# EAGLE design Nucleo-F042K6 - mj8x8 gateway- rev.1 - TCAN334 - poc (EAGLE 9.6.2)
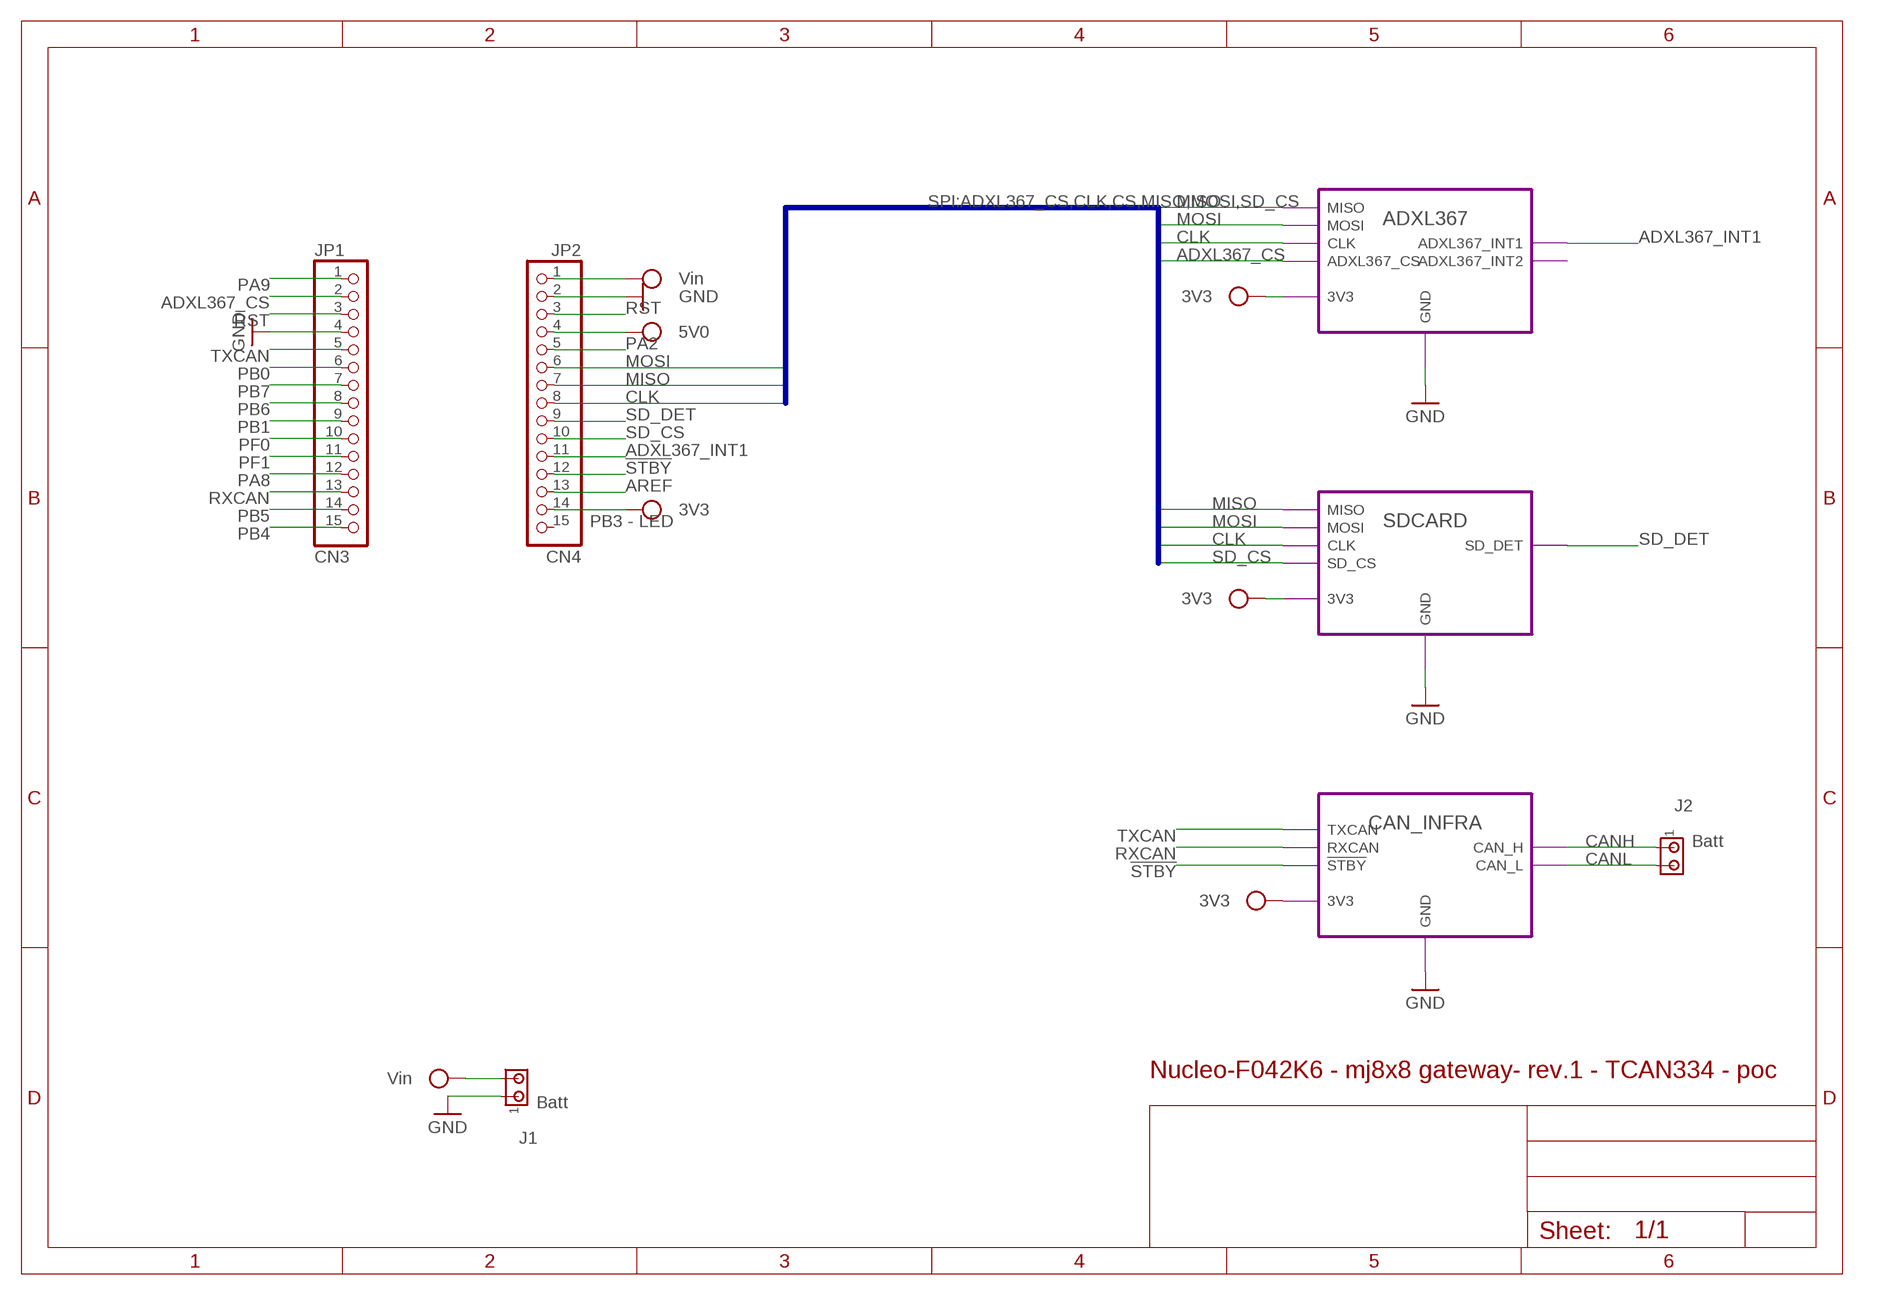
[diagram p0: schematic, sheet 1]

## Parts
J1  Batt  MTA02-100  [10X02MTA]
J2  Batt  MTA02-100  [10X02MTA]
JP1  CN3  PINHD-1X15  [1X15]
JP2  CN4  PINHD-1X15  [1X15]

## Module instances
CAN_INFRA = CAN (part numbers offset by 400)
ADXL367 = ADXL367 (part numbers offset by 200)
SDCARD = SDCARD (part numbers offset by 300)

## Nets
3V3 [3V3]: JP2.14 ; port CAN_INFRA.3V3 SDCARD.3V3 ADXL367.3V3
5V0: JP2.4
!STBY! [signal]: JP2.12 ; port CAN_INFRA.!STBY!
ADXL367_CS: JP1.2 ; port ADXL367.ADXL367_CS
ADXL367_INT1: JP2.11 ; port ADXL367.ADXL367_INT1
AREF: JP2.13
CANH: J2.1 ; port CAN_INFRA.CAN_H
CANL: J2.2 ; port CAN_INFRA.CAN_L
CLK: JP2.8 ; port SDCARD.CLK ADXL367.CLK
GND: J1.1 JP1.4 JP2.2 ; port CAN_INFRA.GND SDCARD.GND ADXL367.GND
MISO: JP2.7 ; port SDCARD.MISO ADXL367.MISO
MOSI: JP2.6 ; port SDCARD.MOSI ADXL367.MOSI
PA2: JP2.5
PA8: JP1.12
PA9: JP1.1
PB0: JP1.6
PB1: JP1.9
PB4: JP1.15
PB5: JP1.14
PB6: JP1.8
PB7: JP1.7
PF0: JP1.10
PF1: JP1.11
RST: JP1.3 JP2.3
RXCAN [signal]: JP1.13 ; port CAN_INFRA.RXCAN
SD_CS: JP2.10 ; port SDCARD.SD_CS
SD_DET: JP2.9 ; port SDCARD.SD_DET
TXCAN [signal]: JP1.5 ; port CAN_INFRA.TXCAN
VIN [3V3]: J1.2 JP2.1 ; supply symbol labelled Vin
Unconnected: JP2.15

## Buses
SPI:ADXL367_CS,CLK,CS,MISO,MOSI,SD_CS

## Notes on the sheet
- PB3 - LED

## Library data of the parts
J1 J2 = con-amp:MTA02-100: AMP connector
JP1 JP2 = pinhead:PINHD-1X15: PIN HEADER

## Module CAN
Ports: TXCAN(in) RXCAN(out) !STBY!(in) 3V3(pwr) GND(pwr) CAN_H(io) CAN_L(io)
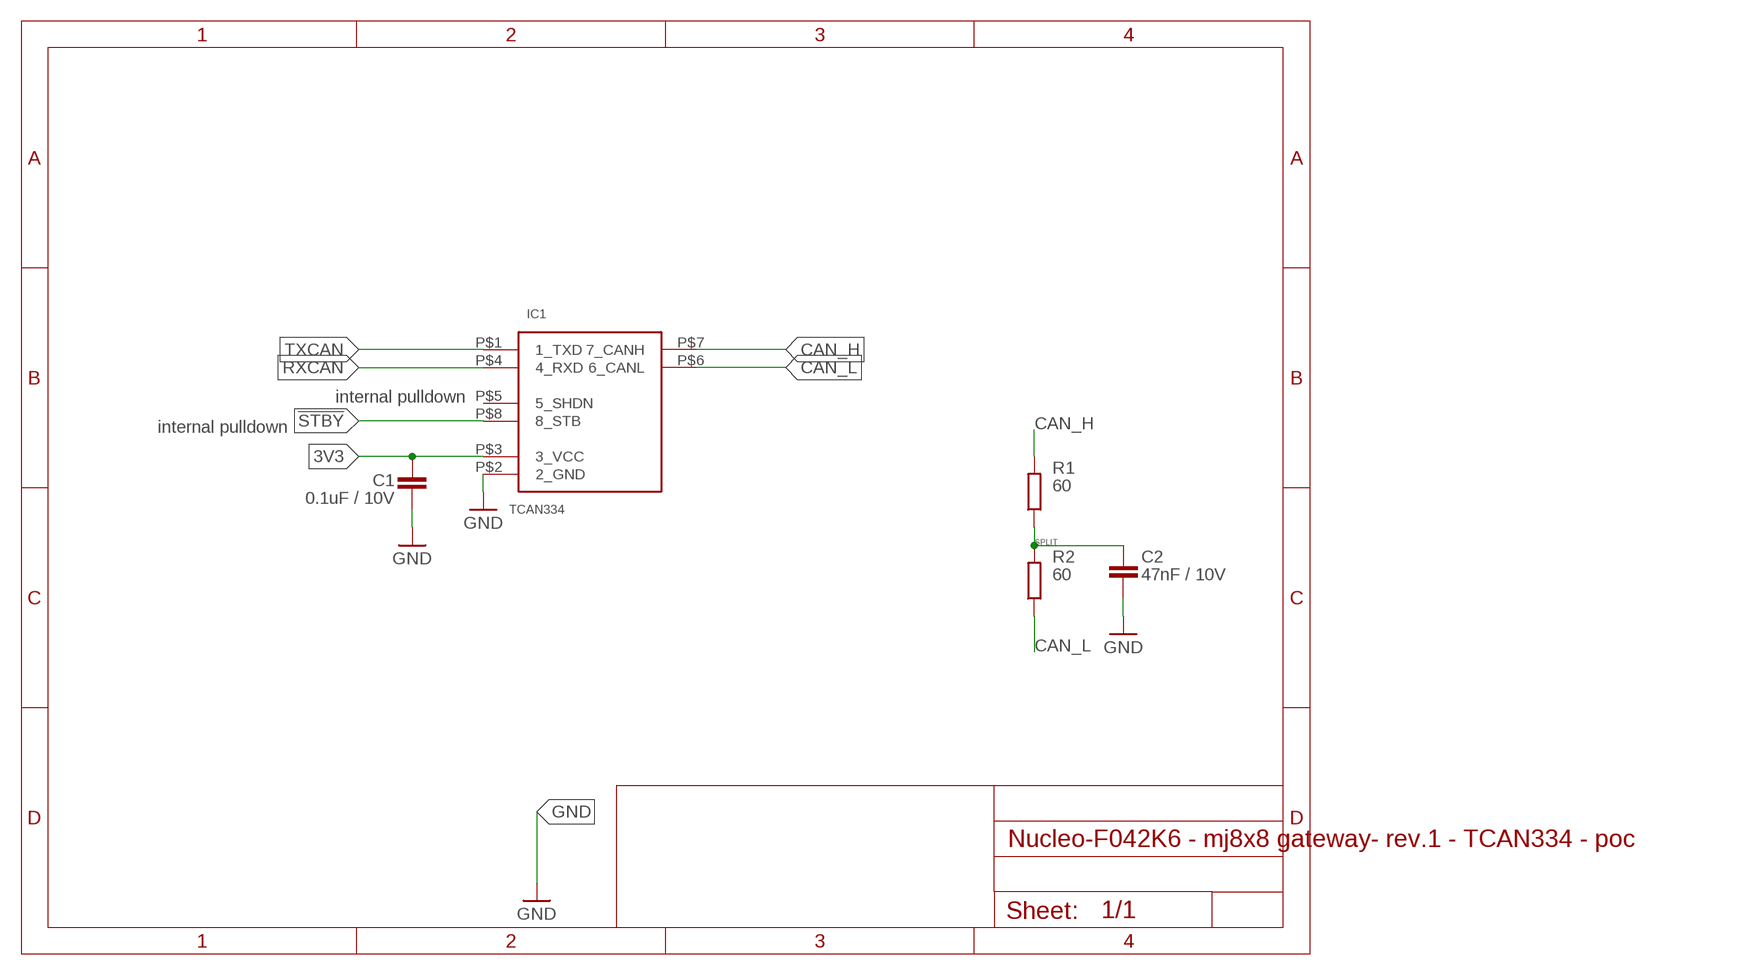
[diagram p1: schematic, module CAN, sheet 1]

### Parts
C1  0.1uF / 10V  C-EUC0402  [C0402]
C2  47nF / 10V  C-EUC0402  [C0402]
IC1  TCAN334  CAN33X  [SOT23-8]
R1  60  R-EU_R0805  [R0805]
R2  60  R-EU_R0805  [R0805]

### Nets
3V3 [3V3]: C1.1 IC1.P$3(3_VCC)
!STBY! [signal]: IC1.P$8(8_STB)
CAN_H [signal]: IC1.P$7(7_CANH) R1.2
CAN_L [signal]: IC1.P$6(6_CANL) R2.1
GND: C1.2 C2.2 IC1.P$2(2_GND)
RXCAN [signal]: IC1.P$4(4_RXD)
SPLIT [signal]: C2.1 R1.1 R2.2
TXCAN [signal]: IC1.P$1(1_TXD)
Unconnected: IC1.P$5(5_SHDN)

### Notes on the sheet
- internal pulldown
- internal pulldown

### Library data of the parts
C1 C2 = rcl:C-EU: CAPACITOR, European symbol; SPICEPREFIX: C
IC1 = TCAN33x - 3.3V CAN Transciever:CAN33X
R1 R2 = rcl:R-EU_: RESISTOR, European symbol; SPICEPREFIX: R

## Module ADXL367
Ports: GND(pwr) 3V3(pwr) MISO(out) MOSI(in) CLK(in) ADXL367_CS(in) ADXL367_INT1(out) ADXL367_INT2(out)
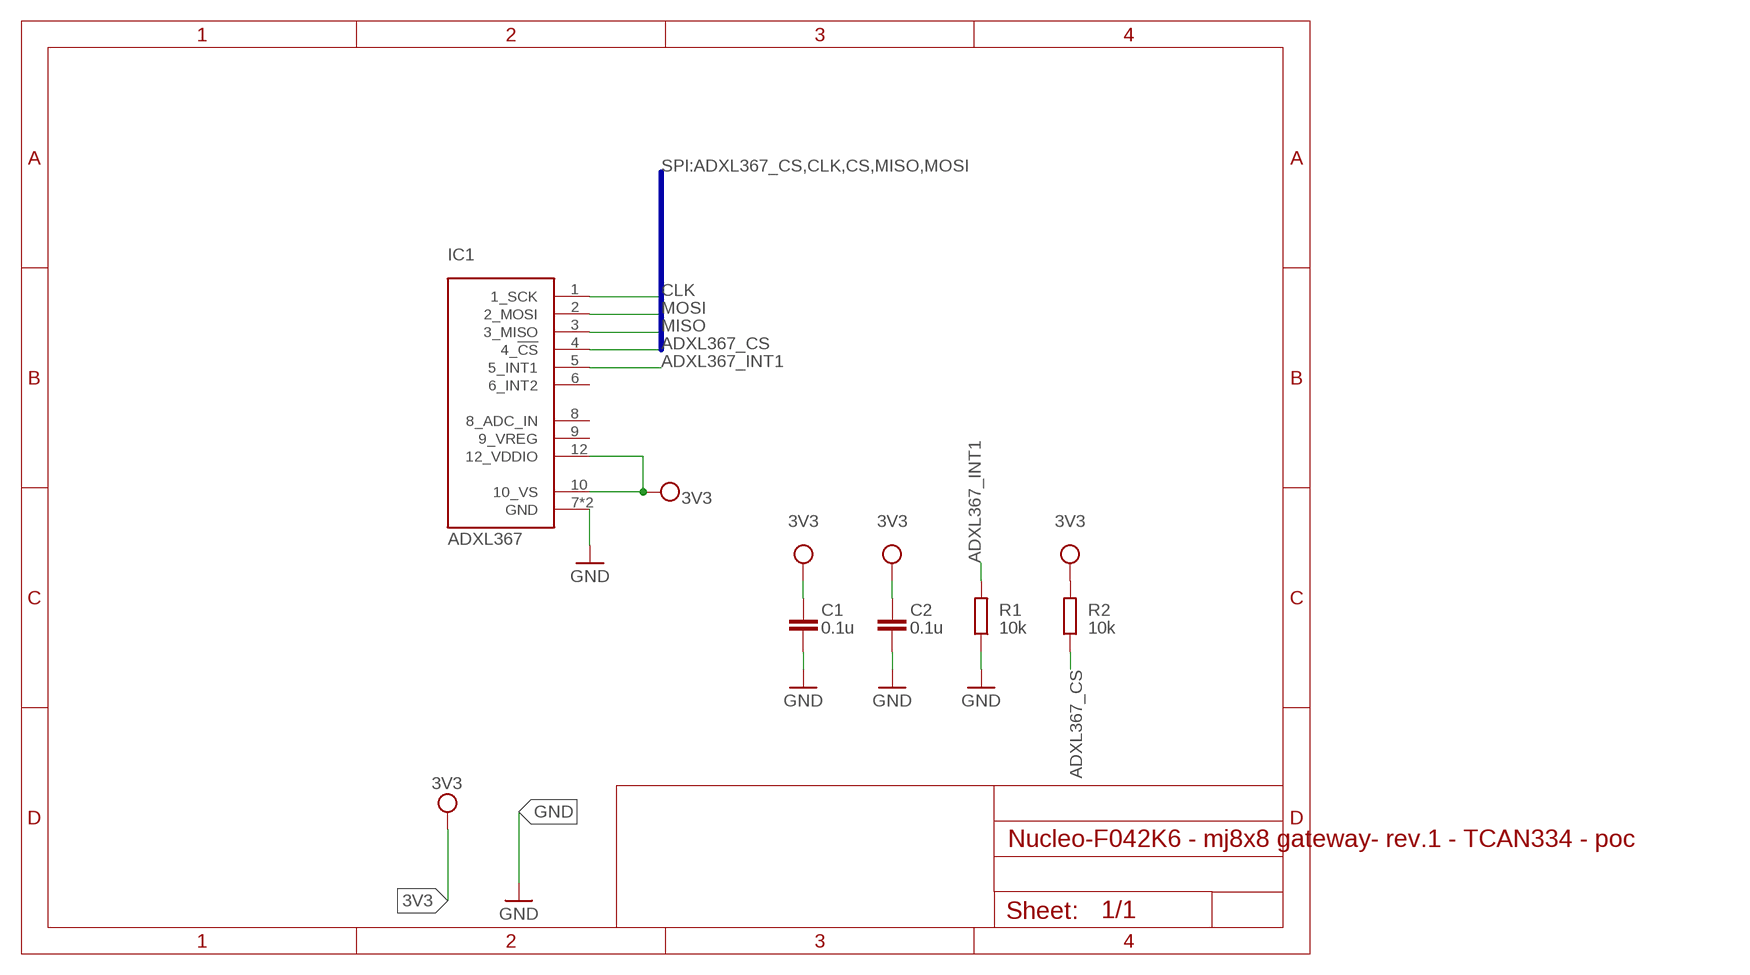
[diagram p2: schematic, module ADXL367, sheet 1]

### Parts
C1  0.1u  C-EUC0402  [C0402]
C2  0.1u  C-EUC0402  [C0402]
IC1  ADXL367  [LGA]
R1  10k  R-EU_R0402  [R0402]
R2  10k  R-EU_R0402  [R0402]

### Nets
3V3 [3V3]: C1.1 C2.1 IC1.10(10_VS) IC1.12(12_VDDIO) R2.2
ADXL367_CS: IC1.4(4_!CS!) R2.1
ADXL367_INT1: IC1.5(5_INT1) R1.2
CLK: IC1.1(1_SCK)
GND: C1.2 C2.2 IC1.7(GND) IC1.11(GND) R1.1
MISO: IC1.3(3_MISO)
MOSI: IC1.2(2_MOSI)
Unconnected: IC1.6(6_INT2) IC1.8(8_ADC_IN)

### Buses
SPI:ADXL367_CS,CLK,CS,MISO,MOSI

### Power pins joined to a net without a drawn wire
9_VREG: IC1.9(9_VREG)

### Library data of the parts
C1 C2 = rcl:C-EU: CAPACITOR, European symbol; SPICEPREFIX: C
IC1 = ADXL 367 - Accelerometer:ADXL367
R1 R2 = rcl:R-EU_: RESISTOR, European symbol; SPICEPREFIX: R

## Module SDCARD
Ports: MISO(out) MOSI(in) CLK(in) SD_CS(in) 3V3(pwr) GND(pwr) SD_DET(out)
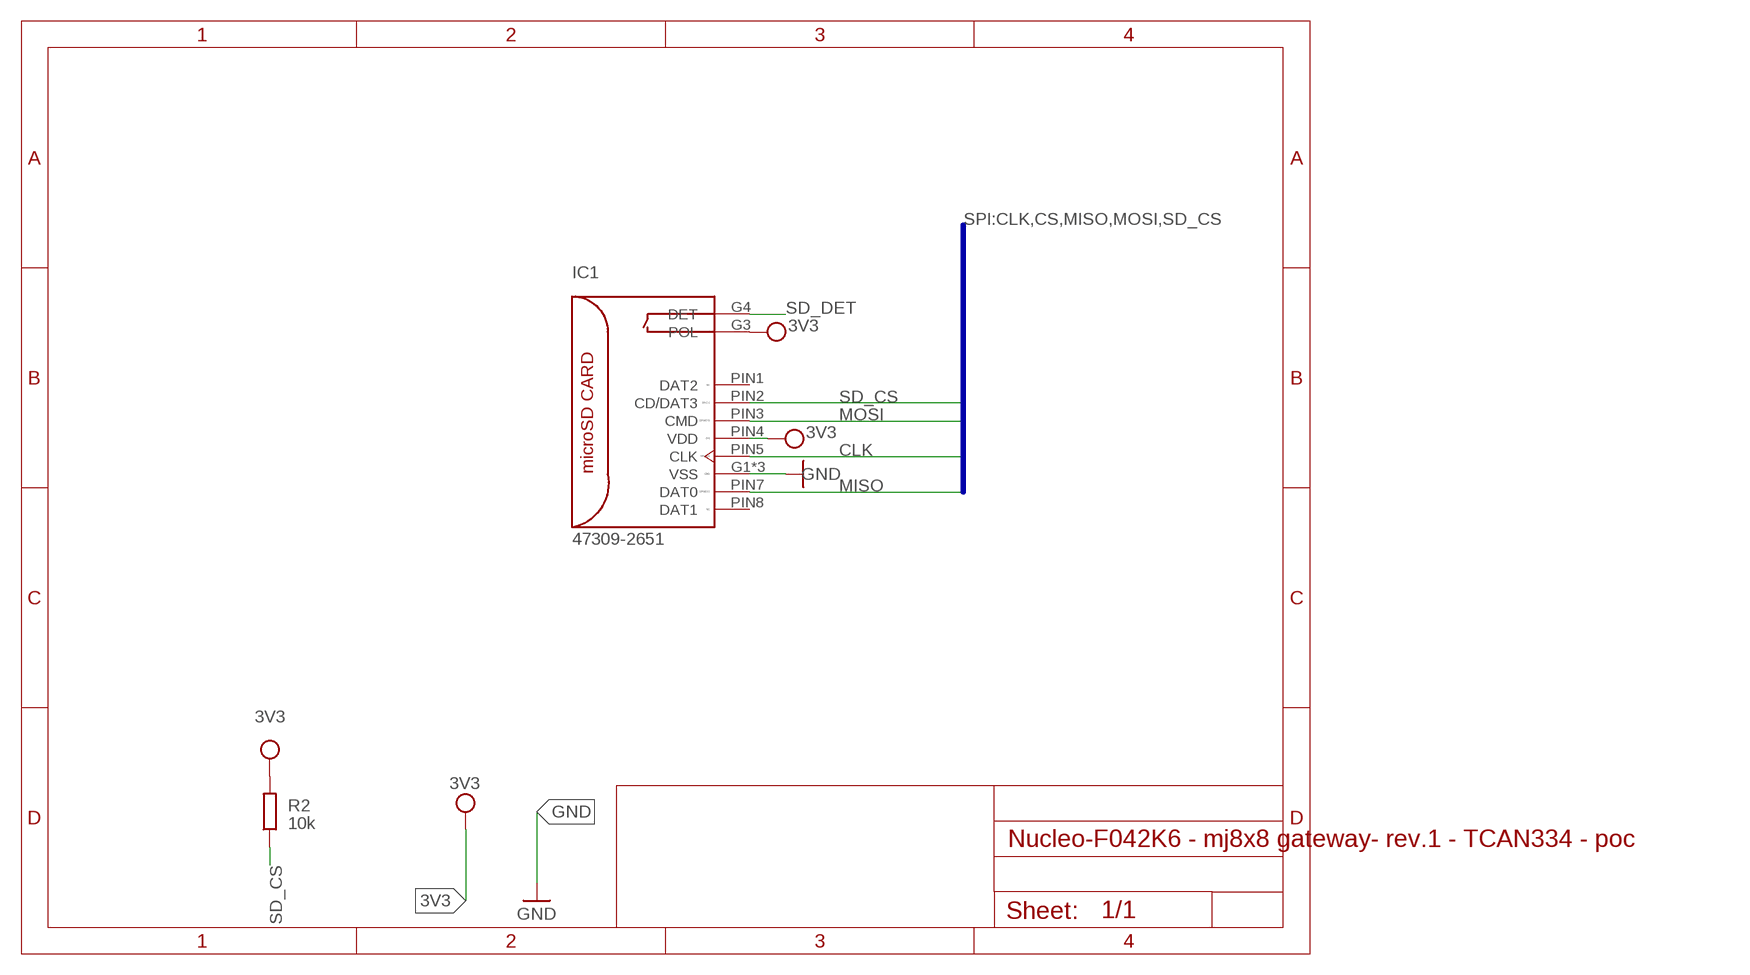
[diagram p3: schematic, module SDCARD, sheet 1]

### Parts
IC1  47309-2651  MICROSD_SPI_MODE  [MICRO_SD_CONNECTOR]
R2  10k  R-EU_R0402  [R0402]

### Nets
3V3 [3V3]: IC1.G3(POL) IC1.PIN4(VDD) R2.2
CLK: IC1.PIN5(CLK)
GND: IC1.G1(VSS) IC1.G2(VSS) IC1.PIN6(VSS)
MISO: IC1.PIN7(DAT0)
MOSI: IC1.PIN3(CMD)
SD_CS: IC1.PIN2(CD/DAT3) R2.1
SD_DET: IC1.G4(DET)
Unconnected: IC1.PIN1(DAT2) IC1.PIN8(DAT1)

### Buses
SPI:CLK,CS,MISO,MOSI,SD_CS

### Library data of the parts
IC1 = Molex SD-47309 SD Card Slot:MICROSD_SPI_MODE: MOLEX - 49225-0821 - CONNECTEUR MICRO SD PUSH/PUSH REV Fabricant: MOLEX Code commande Farnell: 1366700 <http://fr.farnell.com/molex/49225-0821/connecteur-micro-sd-push-push-rev/dp/1366700?Ntt=1366700> Référence fabricant: 49225-0821
R2 = rcl:R-EU_: RESISTOR, European symbol; SPICEPREFIX: R

## Net classes
0 GND: width 0.25 mm, drill 0.35 mm, clearance 0.19 mm
3 signal: width 0.25 mm, drill 0.35 mm, clearance 0.19 mm
4 3V3: width 0.25 mm, drill 0.35 mm, clearance 0.19 mm

## Board
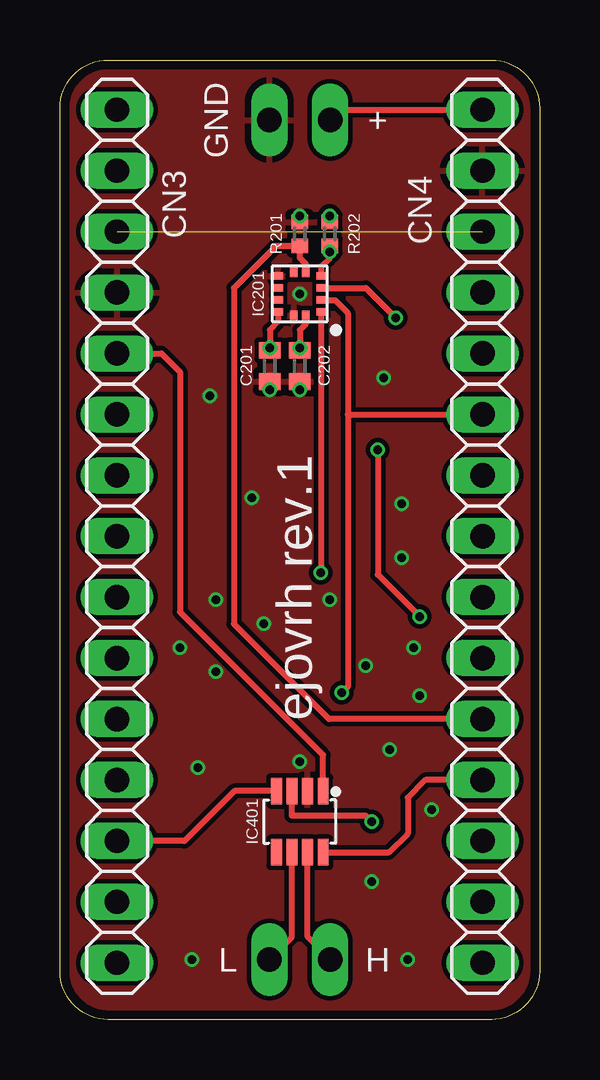
[diagram p4: board, top side]
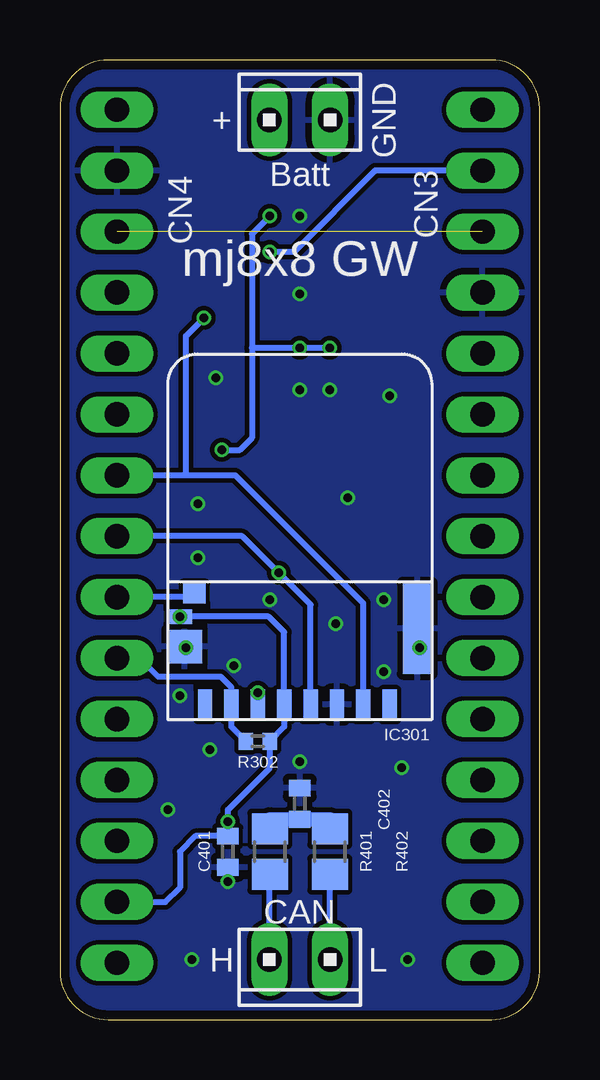
[diagram p5: board, bottom side, seen from below]

Size 20 x 40 mm. Coordinates in mm from the lower left corner, seen from the top.
Outline: 18,0 2,0 arc-90 0,2 0,38 arc-90 2,40 18,40 arc-90 20,38 20,2 arc-90 18,0
Copper layers (1*16): Top 0.035559375mm / dielectric 1.6mm / Bottom 0.035559375mm
Design rules "oshpark-2layer": minimum track width 6mil, minimum drill 10mil, track to track 6mil, track to pad 6mil, pad to pad 6mil, via to via 6mil, smd to smd 6mil, copper to edge 15mil, drill to drill 6mil, minimum pad ring 5mil, minimum via ring 5mil, stop-mask expansion 2.5mil, vias tented up to drill 0mil, thermal gap 10mil

### Footprints (pad centres in the part's own frame; a part is rotated, then mirrored left to right if it is on the bottom)
C0402 = smd 0.7 x 0.9: 1 -0.65,0; 2 0.65,0
LGA = smd 0.39 x 0.33: 1 -0.9,0.75; 2 -0.9,0.25; 3 -0.9,-0.25; 4 -0.9,-0.75; 7 0.9,-0.75; 8 0.9,-0.25; 9 0.9,0.25; 10 0.9,0.75 | smd 0.33 x 0.39: 5 -0.25,-0.9; 6 0.25,-0.9; 11 0.25,0.9; 12 -0.25,0.9
MICRO_SD_CONNECTOR = smd 1.2 x 3.79: G1 0.6,-3.81 | smd 1.45 x 1.4: G2 10.3,-3.05 | smd 1 x 0.6: G3 10.5,-4.3 | smd 0.95 x 0.85: G4 9.9,-5.27 | smd 0.6 x 1.25: PIN1 9.45,-0.63; PIN2 8.35,-0.63; PIN3 7.25,-0.63; PIN4 6.15,-0.63; PIN5 5.05,-0.63; PIN6 3.95,-0.63; PIN7 2.85,-0.63; PIN8 1.75,-0.63
SOT23-8 = smd 0.45 x 1.1: P$1 -0.975,-1.275; P$2 -0.325,-1.275; P$3 0.325,-1.275; P$4 0.975,-1.275; P$5 0.975,1.275; P$6 0.325,1.275; P$7 -0.325,1.275; P$8 -0.975,1.275
10X02MTA = drill 1.016 long: 1 1.27,0; 2 -1.27,0
1X15 = drill 1.016 long: 1 -17.78,0; 2 -15.24,0; 3 -12.7,0; 4 -10.16,0; 5 -7.62,0; 6 -5.08,0; 7 -2.54,0; 8 0,0; 9 2.54,0; 10 5.08,0; 11 7.62,0; 12 10.16,0; 13 12.7,0; 14 15.24,0; 15 17.78,0
R0402 = smd 0.6 x 0.7: 1 -0.5,0; 2 0.5,0
R0805 = smd 1.3 x 1.5: 1 -0.95,0; 2 0.95,0

### Placement (x,y rotation side)
C201  0.1u  [C0402]  8.75,27.25 270 top
C202  0.1u  [C0402]  10,27.25 270 top
C401  0.1uF / 10V  [C0402]  13,7 270 bottom
C402  47nF / 10V  [C0402]  10,9 90 bottom
IC201  ADXL367  [LGA]  10,30.25 180 top
IC301  47309-2651  [MICRO_SD_CONNECTOR]  4.5,12.5 180 bottom
IC401  TCAN334  [SOT23-8]  10,8.25 180 top
J1  10,37.5 0 bottom
J2  10,2.5 180 bottom
JP1  2.38,20.15 270 top
JP2  17.62,20.15 270 top
R201  10k  [R0402]  10,32.75 270 top
R202  10k  [R0402]  11.25,32.75 90 top
R302  10k  [R0402]  11.75,11.6 0 bottom
R401  60  [R0805]  11.25,7 270 bottom
R402  60  [R0805]  8.75,7 90 bottom

### Tracks (layer width: path | path; a pad name or v marks a point on that pad's centre or on a via)
3V3  (via drill 0.35)
  Top 0.25: v13,8.25 12.75,8.5 9.68,8.5 IC401.P$3 | IC201.12 10.25,29 10,28.75 v10,28 C202.1 | v13.25,23.75 13.25,18.55 IC301.G3 | IC201.10 9.1,29.1 8.75,28.75 v8.75,28 C201.1 | R202.2 v11.25,33.5
  Bottom 0.25: JP2.14 15.59,4.91 15,5.5 15,7 14.35,7.65 C401.1 v13,8.25 13,8.75 11.25,10.5 R302.2 10.65,12.2 IC301.PIN4 10.65,16.15 11.3,16.8 IC301.G3 | v11.25,33.5 12,32.75 12,28 | v8.75,28 v10,28 12,28 | v13.25,23.75 12.5,23.75 12,24.25 12,28
  other vias: 15,16.8
!STBY!
  Top 0.25: IC401.P$8 13.72,6.97 14.5,7.75 14.5,9.25 15.24,9.99 JP2.12
ADXL367_CS  (via drill 0.35)
  Top 0.25: IC201.4 10.9,31.4 11.25,31.75 v11.25,32 R202.1
  Bottom 0.25: JP1.2 6.86,35.39 10.25,32 v11.25,32
ADXL367_INT1
  Top 0.25: JP2.11 11.22,12.53 7.25,16.5 7.25,30.5 9,32.25 R201.2 10,31.75 10.25,31.5 IC201.5
CAN_INFRA:SPLIT
  Bottom 0.25: R402.2 8.75,8.35 | R401.1 11.25,8.35
  Bottom 0.61: 8.75,8.35 C402.1 11.25,8.35
CANH
  Top 0.25: J2.1 10.32,3.45 IC401.P$7
  Bottom 0.25: J2.1 11.27,6.03 R401.2
CANL
  Top 0.25: J2.2 9.68,3.45 IC401.P$6
  Bottom 0.25: J2.2 8.73,6.03 R402.1
CLK  (via drill 0.35)
  Top 0.25: IC201.1 10.88,29.48 v10.88,18.62
  Bottom 0.25: IC301.PIN5 9.55,17.3 v10.88,18.62 12.4,20.15 JP2.8
GND  (via drill 0.35)
  other vias: 10,10.75 14.75,15.5 5,15.5 13,5.75 6.5,14.5 8.5,16.5 12.75,14.75 11.25,17.5 14.25,19.25 14.25,21.5 6.5,17.5 10,30.25 8.75,26.25 10,26.25 13.75,11.25 5.5,2.5 14.5,2.5 6.25,26 13.5,26.75 8,21.75 5.75,10.5 15.5,8.75 15,13.5 10,33.5
  pour Top: 0,0 20,0 20,40 0,40
  pour Bottom: 0,0 20,0 20,40 0,40
MISO  (via drill 0.35)
  Top 0.25: v14,29.25 12.75,30.5 IC201.3
  Bottom 0.25: IC301.PIN7 7.35,17.35 12.69,22.69 14.75,22.69 | 14.75,22.69 JP2.7 | 14.75,22.69 14.75,28.5 v14,29.25
MOSI  (via drill 0.35)
  Top 0.25: 12,25.23 12,13.88 v11.75,13.63 | 12,25.23 JP2.6 | IC201.2 10.92,29.98 11.47,29.98 12,29.45 12,25.23
  Bottom 0.25: IC301.PIN3 v11.75,13.63
RST  (1 unrouted)
RXCAN
  Top 0.25: IC401.P$4 7.28,9.53 5.2,7.45 JP1.13
SD_CS
  Bottom 0.25: R302.1 12.85,12.2 IC301.PIN2 12.85,13.85 13.29,14.29 15.91,14.29 16.69,15.07 JP2.10
SD_DET
  Bottom 0.25: IC301.G4 14.56,17.61 JP2.9
TXCAN
  Top 0.25: IC401.P$1 10.97,11.02 5,17 5,27 4.23,27.77 JP1.5
VIN
  Top 0.25: J1.2 11.7,37.93 JP2.1

### Text on the board
tPlace: GND | + | CN3 | CN4 | ejovrh rev.1 | L | H
bPlace: GND | + | Batt | CN3 | CN4 | mj8x8 GW | CAN | L | H